# Altium schematic sheet SD_Card.SchDoc: SD Card
size A4; DrawnBy: Patrik Staudenmayer; DocumentNumber: 6; SheetNumber: 6; SheetTotal: 15
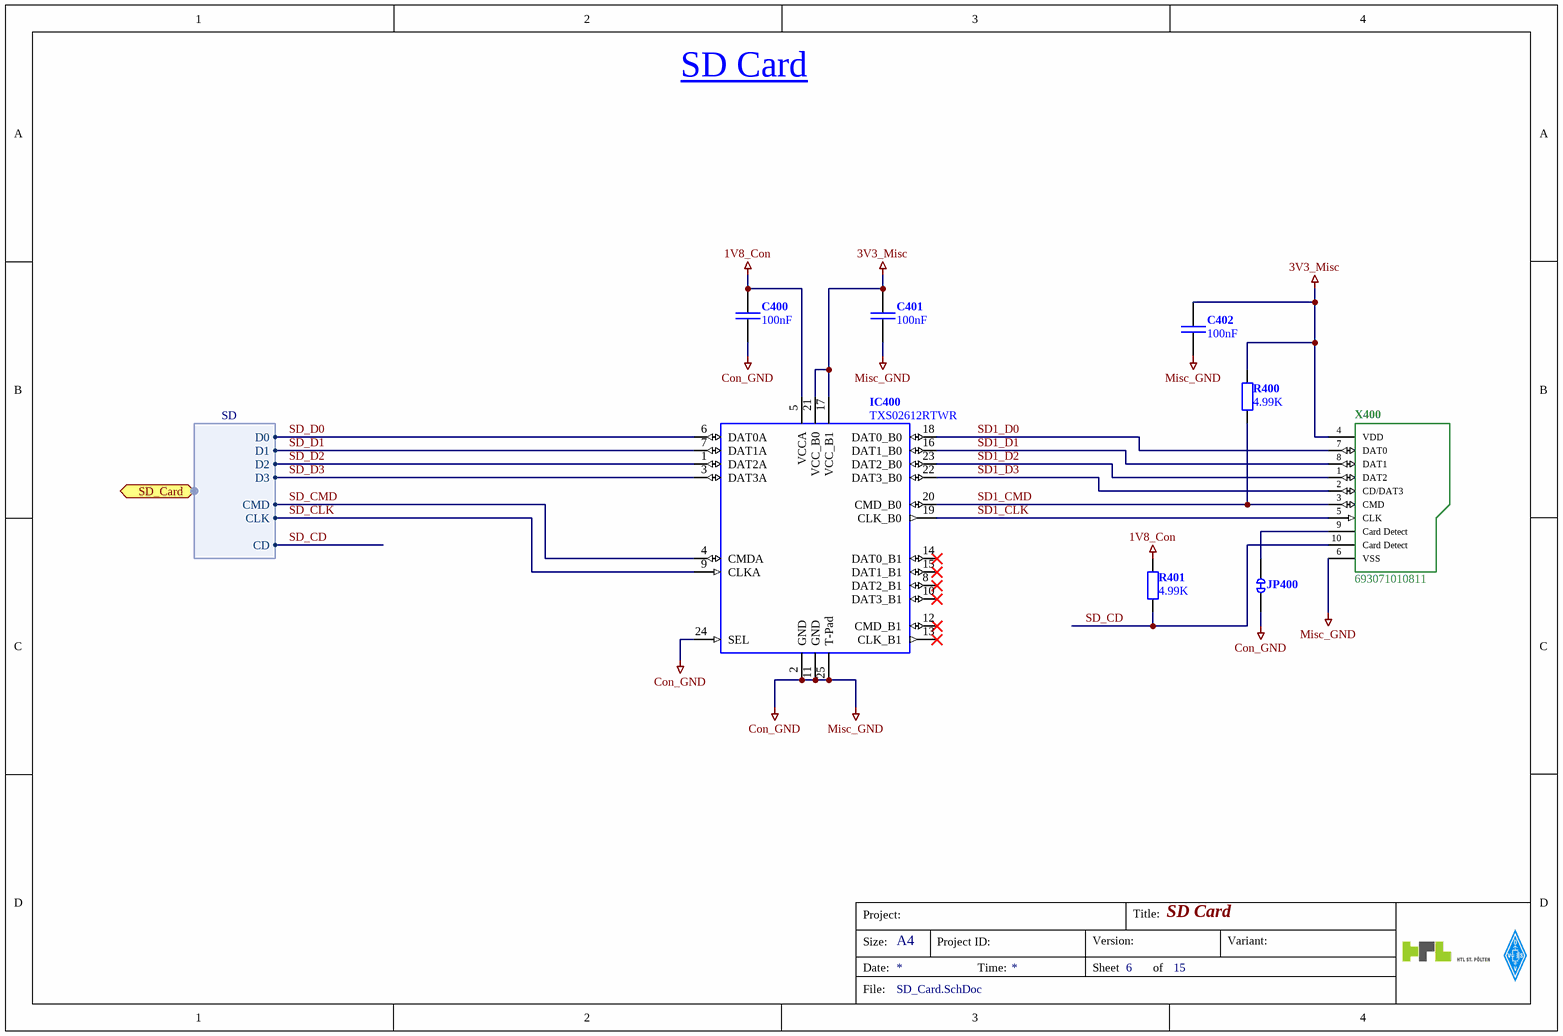
[diagram p0: SD_Card.SchDoc]

## Parts
C400  100nF  [C_0603_N [CAPC1608N IPC]]
C401  100nF  [C_0603_N [CAPC1608N IPC]]
C402  100nF  [C_0603_N [CAPC1608N IPC]]
IC400  TXS02612RTWR  [QFN50P400X400X80_HS-25N IPC]
JP400  JP_Connected  [JP_Connected]  (value not drawn)  (no BOM)
R400  4.99K  [R_0603_N [RESC1608N IPC]]
R401  4.99K  [R_0603_N [RESC1608N IPC]]
X400  693071010811  [X_693071010811]

## Ports
SD_Card (bidir, harness SD)

## Harnesses
SD: CLK, D0, D1, D2, D3, CD, CMD

## Nets
1V8_Con: C400.1 IC400.5(VCCA) R401.2
3V3_Misc: C401.1 C402.1 IC400.17(VCC_B1) IC400.21(VCC_B0) R400.2 X400.4(VDD)
Con_GND: C400.2 C401.2 C402.2 IC400.2(GND) IC400.11(GND) IC400.24(SEL) IC400.25(T-Pad) JP400.2(-) X400.6(VSS)  [also labelled Misc_GND]
SD1_CLK: IC400.19(CLK_B0) X400.5(CLK)
SD1_CMD: IC400.20(CMD_B0) R400.1 X400.3(CMD)
SD1_D0: IC400.18(DAT0_B0) X400.7(DAT0)
SD1_D1: IC400.16(DAT1_B0) X400.8(DAT1)
SD1_D2: IC400.23(DAT2_B0) X400.1(DAT2)
SD1_D3: IC400.22(DAT3_B0) X400.2(CD/DAT3)
SD_CD: R401.1 X400.10(Card_Detect) ; port SD_Card.CD
SD_CLK: IC400.9(CLKA) ; port SD_Card.CLK
SD_CMD: IC400.4(CMDA) ; port SD_Card.CMD
SD_D0: IC400.6(DAT0A) ; port SD_Card.D0
SD_D1: IC400.7(DAT1A) ; port SD_Card.D1
SD_D2: IC400.1(DAT2A) ; port SD_Card.D2
SD_D3: IC400.3(DAT3A) ; port SD_Card.D3
NetJP400_1: JP400.1(+) X400.9(Card_Detect)

Not connected (* = marked no-connect by the designer): IC400 8(DAT2_B1)* 10(DAT3_B1)* 12(CMD_B1)* 13(CLK_B1)* 14(DAT0_B1)* 15(DAT1_B1)*

## Notes on the sheet
- SD Card
- Project:
- Title:
- Size:
- Date:
- A4
- Project ID:
- Time:
- Sheet
- Version:
- of
- Variant:
- File:

## Library data of the parts
C400-C402 = C_GENERIC: Prometheus_ID: *; Prometheus_ManPartNo: 100nF; Prometheus_Manufacturer: *; Prometheus_Comment: 100nF; Prometheus_CurrentFootprint: C_0603_N [CAPC1608N IPC]
IC400 = IC_TXS02612: Prometheus_Manufacturer: Analog Devices; Prometheus_ManPartNo: TXS02612RTWR; Prometheus_Comment: TXS02612RTWR; Prometheus_CurrentFootprint: QFN50P400X400X80_HS-25N IPC
R400 R401 = R_GENERIC_DIN: Prometheus_ID: *; Prometheus_ManPartNo: 4.99K; Prometheus_Manufacturer: *; Prometheus_Comment: 4.99K; Prometheus_CurrentFootprint: R_0603_N [RESC1608N IPC]
X400 = X_693071010811: WR-CRD Micro SD Card Connector, Push & Push, with card detection; Prometheus_Manufacturer: Wuerth Electronics; Prometheus_ID: *; Prometheus_ManPartNo: 693071010811; Prometheus_Comment: 693071010811; Prometheus_CurrentFootprint: X_693071010811
JP400 = JP_Connected: Prometheus_ID: *; Prometheus_ManPartNo: JP_Connected; Prometheus_Manufacturer: *; Prometheus_Comment: JP_Connected; Prometheus_CurrentFootprint: JP_Connected